# EAGLE schematic Payload-A (EAGLE 8.6.3)
DESIGNER: Bradley L. Davis; PROJECT: CougSat-1; REV: 1.0.2
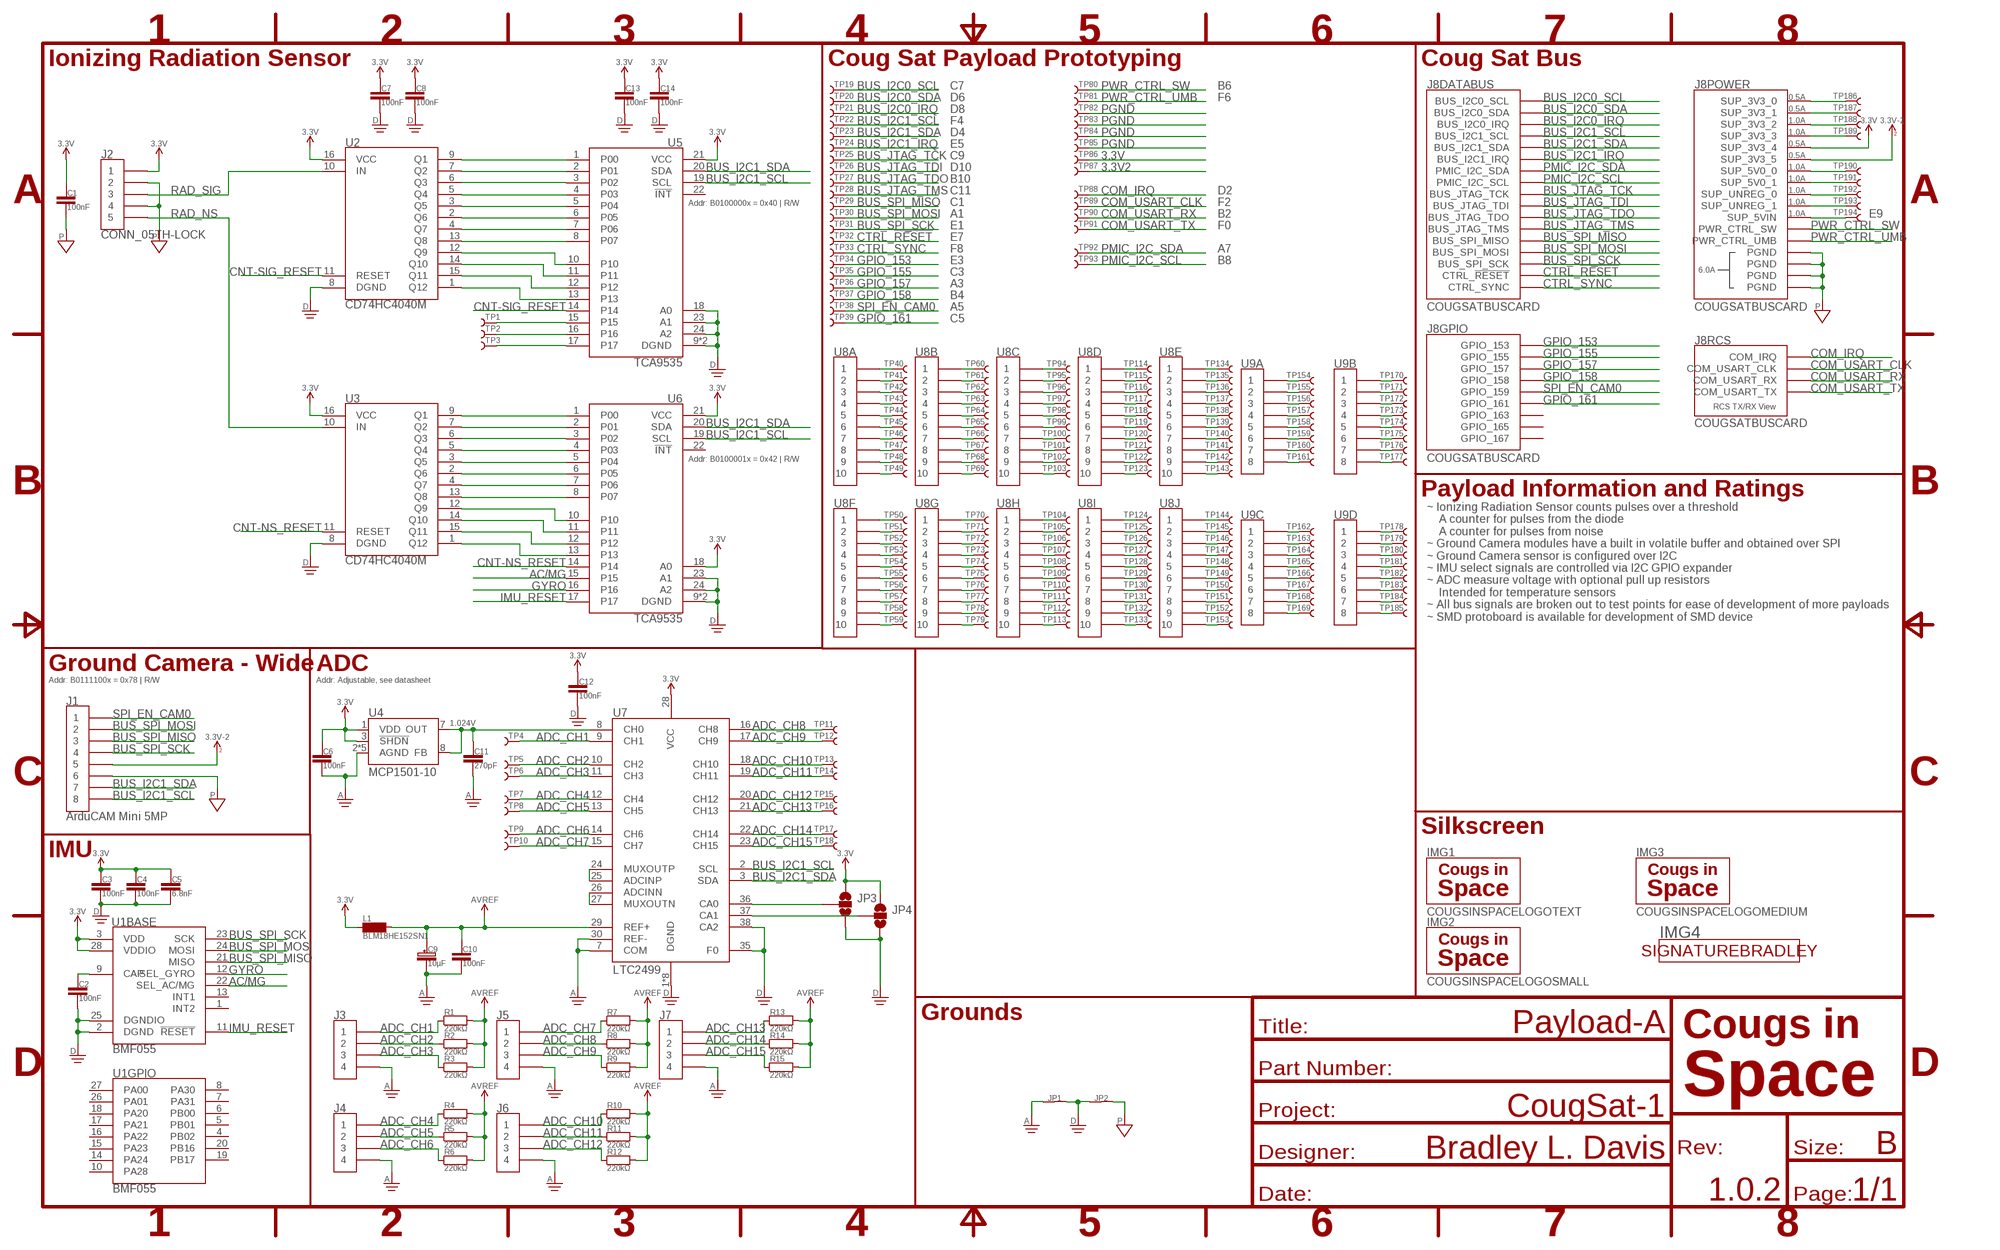
[diagram p0: schematic, sheet 1]

## Parts
C1  100nF  CAPACITOR1608  [1608]
C2  100nF  CAPACITOR1608  [1608]
C3  100nF  CAPACITOR1608  [1608]
C4  100nF  CAPACITOR1608  [1608]
C5  6.8nF  CAPACITOR1608  [1608]
C6  100nF  CAPACITOR1608  [1608]
C7  100nF  CAPACITOR1608  [1608]
C8  100nF  CAPACITOR1608  [1608]
C9  10µF  CAPACITOR-POLARIZED4028  [4028-POL]
C10  100nF  CAPACITOR1608  [1608]
C11  270pF  CAPACITOR1608  [1608]
C12  100nF  CAPACITOR3216  [3216]
C13  100nF  CAPACITOR1608  [1608]
C14  100nF  CAPACITOR1608  [1608]
IMG1  COUGSINSPACELOGOTEXT  [COUGSINSPACETEXT]
IMG2  COUGSINSPACELOGOSMALL  [COUGSINSPACELOGO_SMALL]
IMG3  COUGSINSPACELOGOMEDIUM  [COUGSINSPACELOGO_MEDIUM]
IMG4  SIGNATUREBRADLEY  [SIGNATURE-BRADLEY]
J1  ArduCAM Mini 5MP  CONN_08TH-LOCK  [1X08_LOCK]
J2  CONN_05TH-LOCK  [1X05_LOCK]
J3  CONN_04PICOLOCK1.5MM  [1X04_PICOLOCK1.5MM]
J4  CONN_04PICOLOCK1.5MM  [1X04_PICOLOCK1.5MM]
J5  CONN_04PICOLOCK1.5MM  [1X04_PICOLOCK1.5MM]
J6  CONN_04PICOLOCK1.5MM  [1X04_PICOLOCK1.5MM]
J7  CONN_04PICOLOCK1.5MM  [1X04_PICOLOCK1.5MM]
J8  COUGSATBUSCARD  [COUGSATBUS_MALE-SODIMM]
JP1  SHORTCIRCUIT1608JUMPER  [1608]
JP2  SHORTCIRCUIT1608JUMPER  [1608]
JP3  JUMPER-SMT_3_NO_SILK  [SMT-JUMPER_3_NO_SILK]
JP4  JUMPER-SMT_3_NO_SILK  [SMT-JUMPER_3_NO_SILK]
L1  BLM18HE152SN1  INDUCTOR1608  [1608]
R1  220kΩ  RESISTOR1608  [1608]
R2  220kΩ  RESISTOR1608  [1608]
R3  220kΩ  RESISTOR1608  [1608]
R4  220kΩ  RESISTOR1608  [1608]
R5  220kΩ  RESISTOR1608  [1608]
R6  220kΩ  RESISTOR1608  [1608]
R7  220kΩ  RESISTOR1608  [1608]
R8  220kΩ  RESISTOR1608  [1608]
R9  220kΩ  RESISTOR1608  [1608]
R10  220kΩ  RESISTOR1608  [1608]
R11  220kΩ  RESISTOR1608  [1608]
R12  220kΩ  RESISTOR1608  [1608]
R13  220kΩ  RESISTOR1608  [1608]
R14  220kΩ  RESISTOR1608  [1608]
R15  220kΩ  RESISTOR1608  [1608]
TP1  TEST-POINT1.25MM  [PAD1.25X1.25]
TP2  TEST-POINT1.25MM  [PAD1.25X1.25]
TP3  TEST-POINT1.25MM  [PAD1.25X1.25]
TP4  TEST-POINT1.25MM  [PAD1.25X1.25]
TP5  TEST-POINT1.25MM  [PAD1.25X1.25]
TP6  TEST-POINT1.25MM  [PAD1.25X1.25]
TP7  TEST-POINT1.25MM  [PAD1.25X1.25]
TP8  TEST-POINT1.25MM  [PAD1.25X1.25]
TP9  TEST-POINT1.25MM  [PAD1.25X1.25]
TP10  TEST-POINT1.25MM  [PAD1.25X1.25]
TP11  TEST-POINT1.25MM  [PAD1.25X1.25]
TP12  TEST-POINT1.25MM  [PAD1.25X1.25]
TP13  TEST-POINT1.25MM  [PAD1.25X1.25]
TP14  TEST-POINT1.25MM  [PAD1.25X1.25]
TP15  TEST-POINT1.25MM  [PAD1.25X1.25]
TP16  TEST-POINT1.25MM  [PAD1.25X1.25]
TP17  TEST-POINT1.25MM  [PAD1.25X1.25]
TP18  TEST-POINT1.25MM  [PAD1.25X1.25]
TP19  TEST-POINT1.25MM  [PAD1.25X1.25]
TP20  TEST-POINT1.25MM  [PAD1.25X1.25]
TP21  TEST-POINT1.25MM  [PAD1.25X1.25]
TP22  TEST-POINT1.25MM  [PAD1.25X1.25]
TP23  TEST-POINT1.25MM  [PAD1.25X1.25]
TP24  TEST-POINT1.25MM  [PAD1.25X1.25]
TP25  TEST-POINT1.25MM  [PAD1.25X1.25]
TP26  TEST-POINT1.25MM  [PAD1.25X1.25]
TP27  TEST-POINT1.25MM  [PAD1.25X1.25]
TP28  TEST-POINT1.25MM  [PAD1.25X1.25]
TP29  TEST-POINT1.25MM  [PAD1.25X1.25]
TP30  TEST-POINT1.25MM  [PAD1.25X1.25]
TP31  TEST-POINT1.25MM  [PAD1.25X1.25]
TP32  TEST-POINT1.25MM  [PAD1.25X1.25]
TP33  TEST-POINT1.25MM  [PAD1.25X1.25]
TP34  TEST-POINT1.25MM  [PAD1.25X1.25]
TP35  TEST-POINT1.25MM  [PAD1.25X1.25]
TP36  TEST-POINT1.25MM  [PAD1.25X1.25]
TP37  TEST-POINT1.25MM  [PAD1.25X1.25]
TP38  TEST-POINT1.25MM  [PAD1.25X1.25]
TP39  TEST-POINT1.25MM  [PAD1.25X1.25]
TP40  TEST-POINT1MM  [PAD1X1]
TP41  TEST-POINT1MM  [PAD1X1]
TP42  TEST-POINT1MM  [PAD1X1]
TP43  TEST-POINT1MM  [PAD1X1]
TP44  TEST-POINT1MM  [PAD1X1]
TP45  TEST-POINT1MM  [PAD1X1]
TP46  TEST-POINT1MM  [PAD1X1]
TP47  TEST-POINT1MM  [PAD1X1]
TP48  TEST-POINT1MM  [PAD1X1]
TP49  TEST-POINT1MM  [PAD1X1]
TP50  TEST-POINT1MM  [PAD1X1]
TP51  TEST-POINT1MM  [PAD1X1]
TP52  TEST-POINT1MM  [PAD1X1]
TP53  TEST-POINT1MM  [PAD1X1]
TP54  TEST-POINT1MM  [PAD1X1]
TP55  TEST-POINT1MM  [PAD1X1]
TP56  TEST-POINT1MM  [PAD1X1]
TP57  TEST-POINT1MM  [PAD1X1]
TP58  TEST-POINT1MM  [PAD1X1]
TP59  TEST-POINT1MM  [PAD1X1]
TP60  TEST-POINT1MM  [PAD1X1]
TP61  TEST-POINT1MM  [PAD1X1]
TP62  TEST-POINT1MM  [PAD1X1]
TP63  TEST-POINT1MM  [PAD1X1]
TP64  TEST-POINT1MM  [PAD1X1]
TP65  TEST-POINT1MM  [PAD1X1]
TP66  TEST-POINT1MM  [PAD1X1]
TP67  TEST-POINT1MM  [PAD1X1]
TP68  TEST-POINT1MM  [PAD1X1]
TP69  TEST-POINT1MM  [PAD1X1]
TP70  TEST-POINT1MM  [PAD1X1]
TP71  TEST-POINT1MM  [PAD1X1]
TP72  TEST-POINT1MM  [PAD1X1]
TP73  TEST-POINT1MM  [PAD1X1]
TP74  TEST-POINT1MM  [PAD1X1]
TP75  TEST-POINT1MM  [PAD1X1]
TP76  TEST-POINT1MM  [PAD1X1]
TP77  TEST-POINT1MM  [PAD1X1]
TP78  TEST-POINT1MM  [PAD1X1]
TP79  TEST-POINT1MM  [PAD1X1]
TP80  TEST-POINT1.25MM  [PAD1.25X1.25]
TP81  TEST-POINT1.25MM  [PAD1.25X1.25]
TP82  TEST-POINT1.25MM  [PAD1.25X1.25]
TP83  TEST-POINT1.25MM  [PAD1.25X1.25]
TP84  TEST-POINT1.25MM  [PAD1.25X1.25]
TP85  TEST-POINT1.25MM  [PAD1.25X1.25]
TP86  TEST-POINT1.25MM  [PAD1.25X1.25]
TP87  TEST-POINT1.25MM  [PAD1.25X1.25]
TP88  TEST-POINT1.25MM  [PAD1.25X1.25]
TP89  TEST-POINT1.25MM  [PAD1.25X1.25]
TP90  TEST-POINT1.25MM  [PAD1.25X1.25]
TP91  TEST-POINT1.25MM  [PAD1.25X1.25]
TP92  TEST-POINT1.25MM  [PAD1.25X1.25]
TP93  TEST-POINT1.25MM  [PAD1.25X1.25]
TP94  TEST-POINT1MM  [PAD1X1]
TP95  TEST-POINT1MM  [PAD1X1]
TP96  TEST-POINT1MM  [PAD1X1]
TP97  TEST-POINT1MM  [PAD1X1]
TP98  TEST-POINT1MM  [PAD1X1]
TP99  TEST-POINT1MM  [PAD1X1]
TP100  TEST-POINT1MM  [PAD1X1]
TP101  TEST-POINT1MM  [PAD1X1]
TP102  TEST-POINT1MM  [PAD1X1]
TP103  TEST-POINT1MM  [PAD1X1]
TP104  TEST-POINT1MM  [PAD1X1]
TP105  TEST-POINT1MM  [PAD1X1]
TP106  TEST-POINT1MM  [PAD1X1]
TP107  TEST-POINT1MM  [PAD1X1]
TP108  TEST-POINT1MM  [PAD1X1]
TP109  TEST-POINT1MM  [PAD1X1]
TP110  TEST-POINT1MM  [PAD1X1]
TP111  TEST-POINT1MM  [PAD1X1]
TP112  TEST-POINT1MM  [PAD1X1]
TP113  TEST-POINT1MM  [PAD1X1]
TP114  TEST-POINT1MM  [PAD1X1]
TP115  TEST-POINT1MM  [PAD1X1]
TP116  TEST-POINT1MM  [PAD1X1]
TP117  TEST-POINT1MM  [PAD1X1]
TP118  TEST-POINT1MM  [PAD1X1]
TP119  TEST-POINT1MM  [PAD1X1]
TP120  TEST-POINT1MM  [PAD1X1]
TP121  TEST-POINT1MM  [PAD1X1]
TP122  TEST-POINT1MM  [PAD1X1]
TP123  TEST-POINT1MM  [PAD1X1]
TP124  TEST-POINT1MM  [PAD1X1]
TP125  TEST-POINT1MM  [PAD1X1]
TP126  TEST-POINT1MM  [PAD1X1]
TP127  TEST-POINT1MM  [PAD1X1]
TP128  TEST-POINT1MM  [PAD1X1]
TP129  TEST-POINT1MM  [PAD1X1]
TP130  TEST-POINT1MM  [PAD1X1]
TP131  TEST-POINT1MM  [PAD1X1]
TP132  TEST-POINT1MM  [PAD1X1]
TP133  TEST-POINT1MM  [PAD1X1]
TP134  TEST-POINT1MM  [PAD1X1]
TP135  TEST-POINT1MM  [PAD1X1]
TP136  TEST-POINT1MM  [PAD1X1]
TP137  TEST-POINT1MM  [PAD1X1]
TP138  TEST-POINT1MM  [PAD1X1]
TP139  TEST-POINT1MM  [PAD1X1]
TP140  TEST-POINT1MM  [PAD1X1]
TP141  TEST-POINT1MM  [PAD1X1]
TP142  TEST-POINT1MM  [PAD1X1]
TP143  TEST-POINT1MM  [PAD1X1]
TP144  TEST-POINT1MM  [PAD1X1]
TP145  TEST-POINT1MM  [PAD1X1]
TP146  TEST-POINT1MM  [PAD1X1]
TP147  TEST-POINT1MM  [PAD1X1]
TP148  TEST-POINT1MM  [PAD1X1]
TP149  TEST-POINT1MM  [PAD1X1]
TP150  TEST-POINT1MM  [PAD1X1]
TP151  TEST-POINT1MM  [PAD1X1]
TP152  TEST-POINT1MM  [PAD1X1]
TP153  TEST-POINT1MM  [PAD1X1]
TP154  TEST-POINT1MM  [PAD1X1]
TP155  TEST-POINT1MM  [PAD1X1]
TP156  TEST-POINT1MM  [PAD1X1]
TP157  TEST-POINT1MM  [PAD1X1]
TP158  TEST-POINT1MM  [PAD1X1]
TP159  TEST-POINT1MM  [PAD1X1]
TP160  TEST-POINT1MM  [PAD1X1]
TP161  TEST-POINT1MM  [PAD1X1]
TP162  TEST-POINT1MM  [PAD1X1]
TP163  TEST-POINT1MM  [PAD1X1]
TP164  TEST-POINT1MM  [PAD1X1]
TP165  TEST-POINT1MM  [PAD1X1]
TP166  TEST-POINT1MM  [PAD1X1]
TP167  TEST-POINT1MM  [PAD1X1]
TP168  TEST-POINT1MM  [PAD1X1]
TP169  TEST-POINT1MM  [PAD1X1]
TP170  TEST-POINT1MM  [PAD1X1]
TP171  TEST-POINT1MM  [PAD1X1]
TP172  TEST-POINT1MM  [PAD1X1]
TP173  TEST-POINT1MM  [PAD1X1]
TP174  TEST-POINT1MM  [PAD1X1]
TP175  TEST-POINT1MM  [PAD1X1]
TP176  TEST-POINT1MM  [PAD1X1]
TP177  TEST-POINT1MM  [PAD1X1]
TP178  TEST-POINT1MM  [PAD1X1]
TP179  TEST-POINT1MM  [PAD1X1]
TP180  TEST-POINT1MM  [PAD1X1]
TP181  TEST-POINT1MM  [PAD1X1]
TP182  TEST-POINT1MM  [PAD1X1]
TP183  TEST-POINT1MM  [PAD1X1]
TP184  TEST-POINT1MM  [PAD1X1]
TP185  TEST-POINT1MM  [PAD1X1]
TP186  TEST-POINT1.25MM  [PAD1.25X1.25]
TP187  TEST-POINT1.25MM  [PAD1.25X1.25]
TP188  TEST-POINT1.25MM  [PAD1.25X1.25]
TP189  TEST-POINT1.25MM  [PAD1.25X1.25]
TP190  TEST-POINT1.25MM  [PAD1.25X1.25]
TP191  TEST-POINT1.25MM  [PAD1.25X1.25]
TP192  TEST-POINT1.25MM  [PAD1.25X1.25]
TP193  TEST-POINT1.25MM  [PAD1.25X1.25]
TP194  TEST-POINT1.25MM  [PAD1.25X1.25]
U1  BMF055  [LGA28-4X5MM]
U2  CD74HC4040M  COUNTER-RIPPLE_12STAGESO16  [SO16]
U3  CD74HC4040M  COUNTER-RIPPLE_12STAGESO16  [SO16]
U4  MCP1501-10  VOLTAGEREFERENCEWDFN8  [WDFN8-2X2]
U5  TCA9535  IOEXPANDER_16BITQFN24  [QFN24-4X4]
U6  TCA9535  IOEXPANDER_16BITQFN24  [QFN24-4X4]
U7  LTC2499  [QFN38-5X7]
U8  PROTOBOARD-100SMD0.5MM  [PROTOBOARD-SMD0.5MM]
U9  PROTOBOARD-32SOIC  [PROTOBOARD-SOIC]

## Nets
3.3V: C1.1 C3.1 C4.1 C5.1 C6.1 C7.1 C8.1 C12.1 C13.1 C14.1 J2.1 J8.42(POWER:SUP_3V3_4) J8.44(POWER:SUP_3V3_4) J8.46(POWER:SUP_3V3_4) J8.48(POWER:SUP_3V3_4) J8.50(POWER:SUP_3V3_4) JP3.1 JP4.1 L1.2 TP86.1 U1.3(BASE:VDD) U1.28(BASE:VDDIO) U2.16(VCC) U3.16(VCC) U4.1(VDD) U4.3(!SHDN) U5.21(VCC) U6.18(A0) U6.21(VCC) U7.28(VCC)
3.3V2: J1.5 J8.52(POWER:SUP_3V3_5) J8.54(POWER:SUP_3V3_5) J8.56(POWER:SUP_3V3_5) J8.58(POWER:SUP_3V3_5) J8.60(POWER:SUP_3V3_5) TP87.1 ; supply symbol labelled 3.3V-2
AC/MG: U1.22(BASE:SEL_AC/MG) U6.15
ADC_CA0: JP3.2 U7.36(CA0)
ADC_CA1: JP4.2 U7.37(CA1)
ADC_CH1: J3.1 R1.1 TP4.1 U7.9(CH1)
ADC_CH2: J3.2 R2.1 TP5.1 U7.10(CH2)
ADC_CH3: J3.3 R3.1 TP6.1 U7.11(CH3)
ADC_CH4: J4.1 R4.1 TP7.1 U7.12(CH4)
ADC_CH5: J4.2 R5.1 TP8.1 U7.13(CH5)
ADC_CH6: J4.3 R6.1 TP9.1 U7.14(CH6)
ADC_CH7: J5.1 R7.1 TP10.1 U7.15(CH7)
ADC_CH8: J5.2 R8.1 TP11.1 U7.16(CH8)
ADC_CH9: J5.3 R9.1 TP12.1 U7.17(CH9)
ADC_CH10: J6.1 R10.1 TP13.1 U7.18(CH10)
ADC_CH11: J6.2 R11.1 TP14.1 U7.19(CH11)
ADC_CH12: J6.3 R12.1 TP15.1 U7.20(CH12)
ADC_CH13: J7.1 R13.1 TP16.1 U7.21(CH13)
ADC_CH14: J7.2 R14.1 TP17.1 U7.22(CH14)
ADC_CH15: J7.3 R15.1 TP18.1 U7.23(CH15)
ADC_VREF_ICOUT: C11.1 U4.7(OUT) U4.8(FB) U7.8(CH0)
ADCS_ADCINP: U7.24(MUXOUTP) U7.25(ADCINP)
ADCS_ADCSINN: U7.26(ADCINN) U7.27(MUXOUTN)
AGND: C6.2 C9.C C10.2 C11.2 J3.4 J4.4 J5.4 J6.4 J7.4 JP1.1 U4.2(AGND) U4.4(AGND) U4.5(AGND) U4.6(AGND) U4.PAD(AGND) U7.7(COM) U7.30(REF-)
AVREF: C9.A C10.1 L1.1 R1.2 R2.2 R3.2 R4.2 R5.2 R6.2 R7.2 R8.2 R9.2 R10.2 R11.2 R12.2 R13.2 R14.2 R15.2 U7.29(REF+)
BUS_I2C0_IRQ: J8.177(DATABUS:BUS_I2C0_IRQ) J8.179(DATABUS:BUS_I2C0_IRQ) TP21.1
BUS_I2C0_SCL: J8.173(DATABUS:BUS_I2C0_SCL) J8.175(DATABUS:BUS_I2C0_SCL) TP19.1
BUS_I2C0_SDA: J8.169(DATABUS:BUS_I2C0_SDA) J8.171(DATABUS:BUS_I2C0_SDA) TP20.1
BUS_I2C1_IRQ: J8.164(DATABUS:BUS_I2C1_IRQ) TP24.1
BUS_I2C1_SCL: J1.8 J8.160(DATABUS:BUS_I2C1_SCL) TP22.1 U5.19(SCL) U6.19(SCL) U7.2(SCL)
BUS_I2C1_SDA: J1.7 J8.162(DATABUS:BUS_I2C1_SDA) TP23.1 U5.20(SDA) U6.20(SDA) U7.3(SDA)
BUS_JTAG_TCK: J8.185(DATABUS:BUS_JTAG_TCK) J8.187(DATABUS:BUS_JTAG_TCK) TP25.1
BUS_JTAG_TDI: J8.189(DATABUS:BUS_JTAG_TDI) J8.191(DATABUS:BUS_JTAG_TDI) TP26.1
BUS_JTAG_TDO: J8.193(DATABUS:BUS_JTAG_TDO) J8.195(DATABUS:BUS_JTAG_TDO) TP27.1
BUS_JTAG_TMS: J8.197(DATABUS:BUS_JTAG_TMS) J8.199(DATABUS:BUS_JTAG_TMS) TP28.1
BUS_SPI_MISO: J1.3 J8.145(DATABUS:BUS_SPI_MISO) J8.147(DATABUS:BUS_SPI_MISO) TP29.1 U1.21(BASE:MISO)
BUS_SPI_MOSI: J1.2 J8.149(DATABUS:BUS_SPI_MOSI) J8.151(DATABUS:BUS_SPI_MOSI) TP30.1 U1.24(BASE:MOSI)
BUS_SPI_SCK: J1.4 J8.141(DATABUS:BUS_SPI_SCK) J8.143(DATABUS:BUS_SPI_SCK) TP31.1 U1.23(BASE:SCK)
CNT-NS_1: U3.9(Q1) U6.1(P00)
CNT-NS_2: U3.7(Q2) U6.2(P01)
CNT-NS_3: U3.6(Q3) U6.3(P02)
CNT-NS_4: U3.5(Q4) U6.4(P03)
CNT-NS_5: U3.3(Q5) U6.5(P04)
CNT-NS_6: U3.2(Q6) U6.6(P05)
CNT-NS_7: U3.4(Q7) U6.7(P06)
CNT-NS_8: U3.13(Q8) U6.8(P07)
CNT-NS_9: U3.12(Q9) U6.10
CNT-NS_10: U3.14(Q10) U6.11
CNT-NS_11: U3.15(Q11) U6.12
CNT-NS_12: U3.1(Q12) U6.13
CNT-NS_RESET: U3.11(RESET) U6.14
CNT-SIG_1: U2.9(Q1) U5.1(P00)
CNT-SIG_2: U2.7(Q2) U5.2(P01)
CNT-SIG_3: U2.6(Q3) U5.3(P02)
CNT-SIG_4: U2.5(Q4) U5.4(P03)
CNT-SIG_5: U2.3(Q5) U5.5(P04)
CNT-SIG_6: U2.2(Q6) U5.6(P05)
CNT-SIG_7: U2.4(Q7) U5.7(P06)
CNT-SIG_8: U2.13(Q8) U5.8(P07)
CNT-SIG_9: U2.12(Q9) U5.10
CNT-SIG_10: U2.14(Q10) U5.11
CNT-SIG_11: U2.15(Q11) U5.12
CNT-SIG_12: U2.1(Q12) U5.13
CNT-SIG_RESET: U2.11(RESET) U5.14
COM_IRQ: J8.154(RCS:COM_IRQ) J8.156(RCS:COM_IRQ) TP88.1
COM_USART_CLK: J8.150(RCS:COM_USART_CLK) J8.152(RCS:COM_USART_CLK) TP89.1
COM_USART_RX: J8.146(RCS:COM_USART_RX) J8.148(RCS:COM_USART_RX) TP90.1
COM_USART_TX: J8.142(RCS:COM_USART_TX) J8.144(RCS:COM_USART_TX) TP91.1
CTRL_!RESET: J8.174(DATABUS:CTRL_!RESET) J8.176(DATABUS:CTRL_!RESET) TP32.1
CTRL_SYNC: J8.178(DATABUS:CTRL_SYNC) J8.180(DATABUS:CTRL_SYNC) TP33.1
DGND: C2.2 C3.2 C4.2 C5.2 C7.2 C8.2 C12.2 C13.2 C14.2 JP1.2 JP2.1 JP3.3 JP4.3 U1.2(BASE:DGND) U1.25(BASE:DGNDIO) U2.8(DGND) U3.8(DGND) U5.9(DGND) U5.18(A0) U5.23(A1) U5.24(A2) U5.PAD(DGND) U6.9(DGND) U6.23(A1) U6.24(A2) U6.PAD(DGND) U7.1(DGND) U7.4(DGND) U7.6(DGND) U7.31(DGND) U7.32(DGND) U7.33(DGND) U7.34(DGND) U7.35(F0) U7.38(CA2) U7.PAD(DGND)
GPIO_153: J8.153(GPIO:GPIO_153) TP34.1
GPIO_155: J8.155(GPIO:GPIO_155) TP35.1
GPIO_157: J8.157(GPIO:GPIO_157) TP36.1
GPIO_158: J8.158(GPIO:GPIO_158) TP37.1
GPIO_161: J8.161(GPIO:GPIO_161) TP39.1
GPIO_P15: TP1.1 U5.15
GPIO_P16: TP2.1 U5.16
GPIO_P17: TP3.1 U5.17
GYRO: U1.12(BASE:SEL_GYRO) U6.16
IMU2_CAP: C2.1 U1.9(BASE:CAP)
IMU_RESET: U1.11(BASE:!RESET) U6.17
PGND: C1.2 J1.6 J2.2 J2.4 J8.1(POWER:PGND) J8.3(POWER:PGND) J8.5(POWER:PGND) J8.7(POWER:PGND) J8.9(POWER:PGND) J8.11(POWER:PGND) J8.13(POWER:PGND) J8.15(POWER:PGND) J8.17(POWER:PGND) J8.19(POWER:PGND) J8.41(POWER:PGND) J8.43(POWER:PGND) J8.45(POWER:PGND) J8.47(POWER:PGND) J8.49(POWER:PGND) J8.51(POWER:PGND) J8.53(POWER:PGND) J8.55(POWER:PGND) J8.57(POWER:PGND) J8.59(POWER:PGND) J8.61(POWER:PGND) J8.63(POWER:PGND) J8.65(POWER:PGND) J8.67(POWER:PGND) J8.69(POWER:PGND) J8.82(POWER:PGND) J8.84(POWER:PGND) J8.86(POWER:PGND) J8.88(POWER:PGND) J8.90(POWER:PGND) J8.92(POWER:PGND) J8.94(POWER:PGND) J8.96(POWER:PGND) J8.98(POWER:PGND) J8.100(POWER:PGND) J8.102(POWER:PGND) J8.104(POWER:PGND) J8.106(POWER:PGND) J8.108(POWER:PGND) J8.110(POWER:PGND) J8.112(POWER:PGND) J8.114(POWER:PGND) J8.116(POWER:PGND) J8.118(POWER:PGND) J8.120(POWER:PGND) J8.122(POWER:PGND) J8.124(POWER:PGND) J8.126(POWER:PGND) J8.128(POWER:PGND) J8.130(POWER:PGND) J8.131(POWER:PGND) J8.132(POWER:PGND) J8.133(POWER:PGND) J8.134(POWER:PGND) J8.135(POWER:PGND) J8.136(POWER:PGND) J8.137(POWER:PGND) J8.138(POWER:PGND) J8.139(POWER:PGND) J8.140(POWER:PGND) JP2.2 TP82.1 TP83.1 TP84.1 TP85.1
PMIC_I2C_SCL: J8.183(DATABUS:PMIC_I2C_SCL) TP93.1
PMIC_I2C_SDA: J8.181(DATABUS:PMIC_I2C_SDA) TP92.1
PWR_CTRL_SW: J8.166(POWER:PWR_CTRL_SW) J8.168(POWER:PWR_CTRL_SW) TP80.1
PWR_CTRL_UMB: J8.170(POWER:PWR_CTRL_UMB) J8.172(POWER:PWR_CTRL_UMB) TP81.1
RAD_NS: J2.5 U3.10(IN)
RAD_SIG: J2.3 U2.10(IN)
SMD0.5-1: TP40.1 U8.1
SMD0.5-2: TP41.1 U8.2
SMD0.5-3: TP42.1 U8.3
SMD0.5-4: TP43.1 U8.4
SMD0.5-5: TP44.1 U8.5
SMD0.5-6: TP45.1 U8.6
SMD0.5-7: TP46.1 U8.7
SMD0.5-8: TP47.1 U8.8
SMD0.5-9: TP48.1 U8.9
SMD0.5-10: TP49.1 U8.10
SMD0.5-11: TP60.1 U8.11
SMD0.5-12: TP61.1 U8.12
SMD0.5-13: TP62.1 U8.13
SMD0.5-14: TP63.1 U8.14
SMD0.5-15: TP64.1 U8.15
SMD0.5-16: TP65.1 U8.16
SMD0.5-17: TP66.1 U8.17
SMD0.5-18: TP67.1 U8.18
SMD0.5-19: TP68.1 U8.19
SMD0.5-20: TP69.1 U8.20
SMD0.5-21: TP94.1 U8.21
SMD0.5-22: TP95.1 U8.22
SMD0.5-23: TP96.1 U8.23
SMD0.5-24: TP97.1 U8.24
SMD0.5-25: TP98.1 U8.25
SMD0.5-26: TP99.1 U8.26
SMD0.5-27: TP100.1 U8.27
SMD0.5-28: TP101.1 U8.28
SMD0.5-29: TP102.1 U8.29
SMD0.5-30: TP103.1 U8.30
SMD0.5-31: TP114.1 U8.31
SMD0.5-32: TP115.1 U8.32
SMD0.5-33: TP116.1 U8.33
SMD0.5-34: TP117.1 U8.34
SMD0.5-35: TP118.1 U8.35
SMD0.5-36: TP119.1 U8.36
SMD0.5-37: TP120.1 U8.37
SMD0.5-38: TP121.1 U8.38
SMD0.5-39: TP122.1 U8.39
SMD0.5-40: TP123.1 U8.40
SMD0.5-41: TP134.1 U8.41
SMD0.5-42: TP135.1 U8.42
SMD0.5-43: TP136.1 U8.43
SMD0.5-44: TP137.1 U8.44
SMD0.5-45: TP138.1 U8.45
SMD0.5-46: TP139.1 U8.46
SMD0.5-47: TP140.1 U8.47
SMD0.5-48: TP141.1 U8.48
SMD0.5-49: TP142.1 U8.49
SMD0.5-50: TP143.1 U8.50
SMD0.5-51: TP50.1 U8.51
SMD0.5-52: TP51.1 U8.52
SMD0.5-53: TP52.1 U8.53
SMD0.5-54: TP53.1 U8.54
SMD0.5-55: TP54.1 U8.55
SMD0.5-56: TP55.1 U8.56
SMD0.5-57: TP56.1 U8.57
SMD0.5-58: TP57.1 U8.58
SMD0.5-59: TP58.1 U8.59
SMD0.5-60: TP59.1 U8.60
SMD0.5-61: TP70.1 U8.61
SMD0.5-62: TP71.1 U8.62
SMD0.5-63: TP72.1 U8.63
SMD0.5-64: TP73.1 U8.64
SMD0.5-65: TP74.1 U8.65
SMD0.5-66: TP75.1 U8.66
SMD0.5-67: TP76.1 U8.67
SMD0.5-68: TP77.1 U8.68
SMD0.5-69: TP78.1 U8.69
SMD0.5-70: TP79.1 U8.70
SMD0.5-71: TP104.1 U8.71
SMD0.5-72: TP105.1 U8.72
SMD0.5-73: TP106.1 U8.73
SMD0.5-74: TP107.1 U8.74
SMD0.5-75: TP108.1 U8.75
SMD0.5-76: TP109.1 U8.76
SMD0.5-77: TP110.1 U8.77
SMD0.5-78: TP111.1 U8.78
SMD0.5-79: TP112.1 U8.79
SMD0.5-80: TP113.1 U8.80
SMD0.5-81: TP124.1 U8.81
SMD0.5-82: TP125.1 U8.82
SMD0.5-83: TP126.1 U8.83
SMD0.5-84: TP127.1 U8.84
SMD0.5-85: TP128.1 U8.85
SMD0.5-86: TP129.1 U8.86
SMD0.5-87: TP130.1 U8.87
SMD0.5-88: TP131.1 U8.88
SMD0.5-89: TP132.1 U8.89
SMD0.5-90: TP133.1 U8.90
SMD0.5-91: TP144.1 U8.91
SMD0.5-92: TP145.1 U8.92
SMD0.5-93: TP146.1 U8.93
SMD0.5-94: TP147.1 U8.94
SMD0.5-95: TP148.1 U8.95
SMD0.5-96: TP149.1 U8.96
SMD0.5-97: TP150.1 U8.97
SMD0.5-98: TP151.1 U8.98
SMD0.5-99: TP152.1 U8.99
SMD0.5-100: TP153.1 U8.100
SOIC-1: TP154.1 U9.1
SOIC-2: TP155.1 U9.2
SOIC-3: TP156.1 U9.3
SOIC-4: TP157.1 U9.4
SOIC-5: TP158.1 U9.5
SOIC-6: TP159.1 U9.6
SOIC-7: TP160.1 U9.7
SOIC-8: TP161.1 U9.8
SOIC-9: TP170.1 U9.9
SOIC-10: TP171.1 U9.10
SOIC-11: TP172.1 U9.11
SOIC-12: TP173.1 U9.12
SOIC-13: TP174.1 U9.13
SOIC-14: TP175.1 U9.14
SOIC-15: TP176.1 U9.15
SOIC-16: TP177.1 U9.16
SOIC-17: TP162.1 U9.17
SOIC-18: TP163.1 U9.18
SOIC-19: TP164.1 U9.19
SOIC-20: TP165.1 U9.20
SOIC-21: TP166.1 U9.21
SOIC-22: TP167.1 U9.22
SOIC-23: TP168.1 U9.23
SOIC-24: TP169.1 U9.24
SOIC-25: TP178.1 U9.25
SOIC-26: TP179.1 U9.26
SOIC-27: TP180.1 U9.27
SOIC-28: TP181.1 U9.28
SOIC-29: TP182.1 U9.29
SOIC-30: TP183.1 U9.30
SOIC-31: TP184.1 U9.31
SOIC-32: TP185.1 U9.32
SPI_EN_CAM0: J1.1 J8.159(GPIO:GPIO_159) TP38.1
SUP_3V3_0: J8.2(POWER:SUP_3V3_0) J8.4(POWER:SUP_3V3_0) J8.6(POWER:SUP_3V3_0) J8.8(POWER:SUP_3V3_0) J8.10(POWER:SUP_3V3_0) TP186.1
SUP_3V3_1: J8.12(POWER:SUP_3V3_1) J8.14(POWER:SUP_3V3_1) J8.16(POWER:SUP_3V3_1) J8.18(POWER:SUP_3V3_1) J8.20(POWER:SUP_3V3_1) TP187.1
SUP_3V3_2: J8.21(POWER:SUP_3V3_2) J8.23(POWER:SUP_3V3_2) J8.25(POWER:SUP_3V3_2) J8.27(POWER:SUP_3V3_2) J8.29(POWER:SUP_3V3_2) J8.31(POWER:SUP_3V3_2) J8.33(POWER:SUP_3V3_2) J8.35(POWER:SUP_3V3_2) J8.37(POWER:SUP_3V3_2) J8.39(POWER:SUP_3V3_2) TP188.1
SUP_3V3_3: J8.22(POWER:SUP_3V3_3) J8.24(POWER:SUP_3V3_3) J8.26(POWER:SUP_3V3_3) J8.28(POWER:SUP_3V3_3) J8.30(POWER:SUP_3V3_3) J8.32(POWER:SUP_3V3_3) J8.34(POWER:SUP_3V3_3) J8.36(POWER:SUP_3V3_3) J8.38(POWER:SUP_3V3_3) J8.40(POWER:SUP_3V3_3) TP189.1
SUP_5V0_0: J8.62(POWER:SUP_5V0_0) J8.64(POWER:SUP_5V0_0) J8.66(POWER:SUP_5V0_0) J8.68(POWER:SUP_5V0_0) J8.70(POWER:SUP_5V0_0) J8.72(POWER:SUP_5V0_0) J8.74(POWER:SUP_5V0_0) J8.76(POWER:SUP_5V0_0) J8.78(POWER:SUP_5V0_0) J8.80(POWER:SUP_5V0_0) TP190.1
SUP_5V0_1: J8.71(POWER:SUP_5V0_1) J8.73(POWER:SUP_5V0_1) J8.75(POWER:SUP_5V0_1) J8.77(POWER:SUP_5V0_1) J8.79(POWER:SUP_5V0_1) J8.81(POWER:SUP_5V0_1) J8.83(POWER:SUP_5V0_1) J8.85(POWER:SUP_5V0_1) J8.87(POWER:SUP_5V0_1) J8.89(POWER:SUP_5V0_1) TP191.1
SUP_5VIN: J8.182(POWER:SUP_5VIN) J8.184(POWER:SUP_5VIN) J8.186(POWER:SUP_5VIN) J8.188(POWER:SUP_5VIN) J8.190(POWER:SUP_5VIN) J8.192(POWER:SUP_5VIN) J8.194(POWER:SUP_5VIN) J8.196(POWER:SUP_5VIN) J8.198(POWER:SUP_5VIN) J8.200(POWER:SUP_5VIN) TP194.1
SUP_UNREG_0: J8.91(POWER:SUP_UNREG_0) J8.93(POWER:SUP_UNREG_0) J8.95(POWER:SUP_UNREG_0) J8.97(POWER:SUP_UNREG_0) J8.99(POWER:SUP_UNREG_0) J8.101(POWER:SUP_UNREG_0) J8.103(POWER:SUP_UNREG_0) J8.105(POWER:SUP_UNREG_0) J8.107(POWER:SUP_UNREG_0) J8.109(POWER:SUP_UNREG_0) TP192.1
SUP_UNREG_1: J8.111(POWER:SUP_UNREG_1) J8.113(POWER:SUP_UNREG_1) J8.115(POWER:SUP_UNREG_1) J8.117(POWER:SUP_UNREG_1) J8.119(POWER:SUP_UNREG_1) J8.121(POWER:SUP_UNREG_1) J8.123(POWER:SUP_UNREG_1) J8.125(POWER:SUP_UNREG_1) J8.127(POWER:SUP_UNREG_1) J8.129(POWER:SUP_UNREG_1) TP193.1
Unconnected: J8.163(GPIO:GPIO_163) J8.165(GPIO:GPIO_165) J8.167(GPIO:GPIO_167) U1.1(BASE:INT2) U1.4(GPIO:PB02) U1.5(GPIO:PB01) U1.6(GPIO:PB00) U1.7(GPIO:PA31) U1.8(GPIO:PA30) U1.10(GPIO:PA28) U1.13(BASE:INT1) U1.14(GPIO:PA24) U1.15(GPIO:PA23) U1.16(GPIO:PA22) U1.17(GPIO:PA21) U1.18(GPIO:PA20) U1.19(GPIO:PB17) U1.20(GPIO:PB16) U1.26(GPIO:PA01) U1.27(GPIO:PA00) U5.22(!INT) U6.22(!INT)

## Notes on the sheet
- Ionizing Radiation Sensor | Coug Sat Payload Prototyping | Coug Sat Bus
- C7 | B6
- D6 | F6
- D8
- F4
- D4
- E5
- C9
- D10
- B10
- C11 | D2
- Addr: B0100000x = 0x40 | R/W | C1 | F2
- A1 | B2 | E9
- E1 | F0
- E7
- F8 | A7
- E3 | B8
- C3
- A3
- B4
- A5
- C5
- Addr: B0100001x = 0x42 | R/W
- Payload Information and Ratings
- ~ Ionizing Radiation Sensor counts pulses over a threshold
      A counter for pulses from the diode
      A counter for pulses from noise
  ~ Ground Camera modules have a built in volatile buffer and obtained over SPI
  ~ Ground Camera sensor is configured over I2C
  ~ IMU select signals are controlled via I2C GPIO expander
  ~ ADC measure voltage with optional pull up resistors
      Intended for temperature sensors
  ~ All bus signals are broken out to test points for ease of development of more payloads
  ~ SMD protoboard is available for development of SMD device
- Ground Camera - Wide | ADC
- Addr: B0111100x = 0x78 | R/W | Addr: Adjustable, see datasheet
- 1.024V
- Silkscreen
- IMU
- Grounds

## Library data of the parts
C1-C8 C10-C14 = CougsInSpace:CAPACITOR
C9 = CougsInSpace:CAPACITOR-POLARIZED
IMG1-IMG3 = CougsInSpace:COUGSINSPACELOGO
IMG4 = CougsInSpace:SIGNATURE
J1 = CougsInSpace:CONN_08
J2 = CougsInSpace:CONN_05
J3-J7 = CougsInSpace:CONN_04
J8 = CougsInSpace:COUGSATBUS
JP1 JP2 = CougsInSpace:SHORTCIRCUIT
JP3 JP4 = CougsInSpace:JUMPER-SMT_3_NO: Normally open jumper This jumper has three pads in close proximity to each other. Apply solder to close the connection(s).
L1 = CougsInSpace:INDUCTOR
R1-R15 = CougsInSpace:RESISTOR
TP1-TP194 = CougsInSpace:TEST-POINT: Bare copper test points for troubleshooting or ICT
U1 = CougsInSpace:BMF055
U2 U3 = CougsInSpace:COUNTER-RIPPLE_12STAGE
U4 = CougsInSpace:VOLTAGEREFERENCE
U5 U6 = CougsInSpace:IOEXPANDER_16BIT
U7 = CougsInSpace:LTC2499
U8 = CougsInSpace:PROTOBOARD-100
U9 = CougsInSpace:PROTOBOARD-32